# Altium schematic sheet POWER_SUPPLY.SchDoc
size A4; SheetNumber: 1; SheetTotal: 3
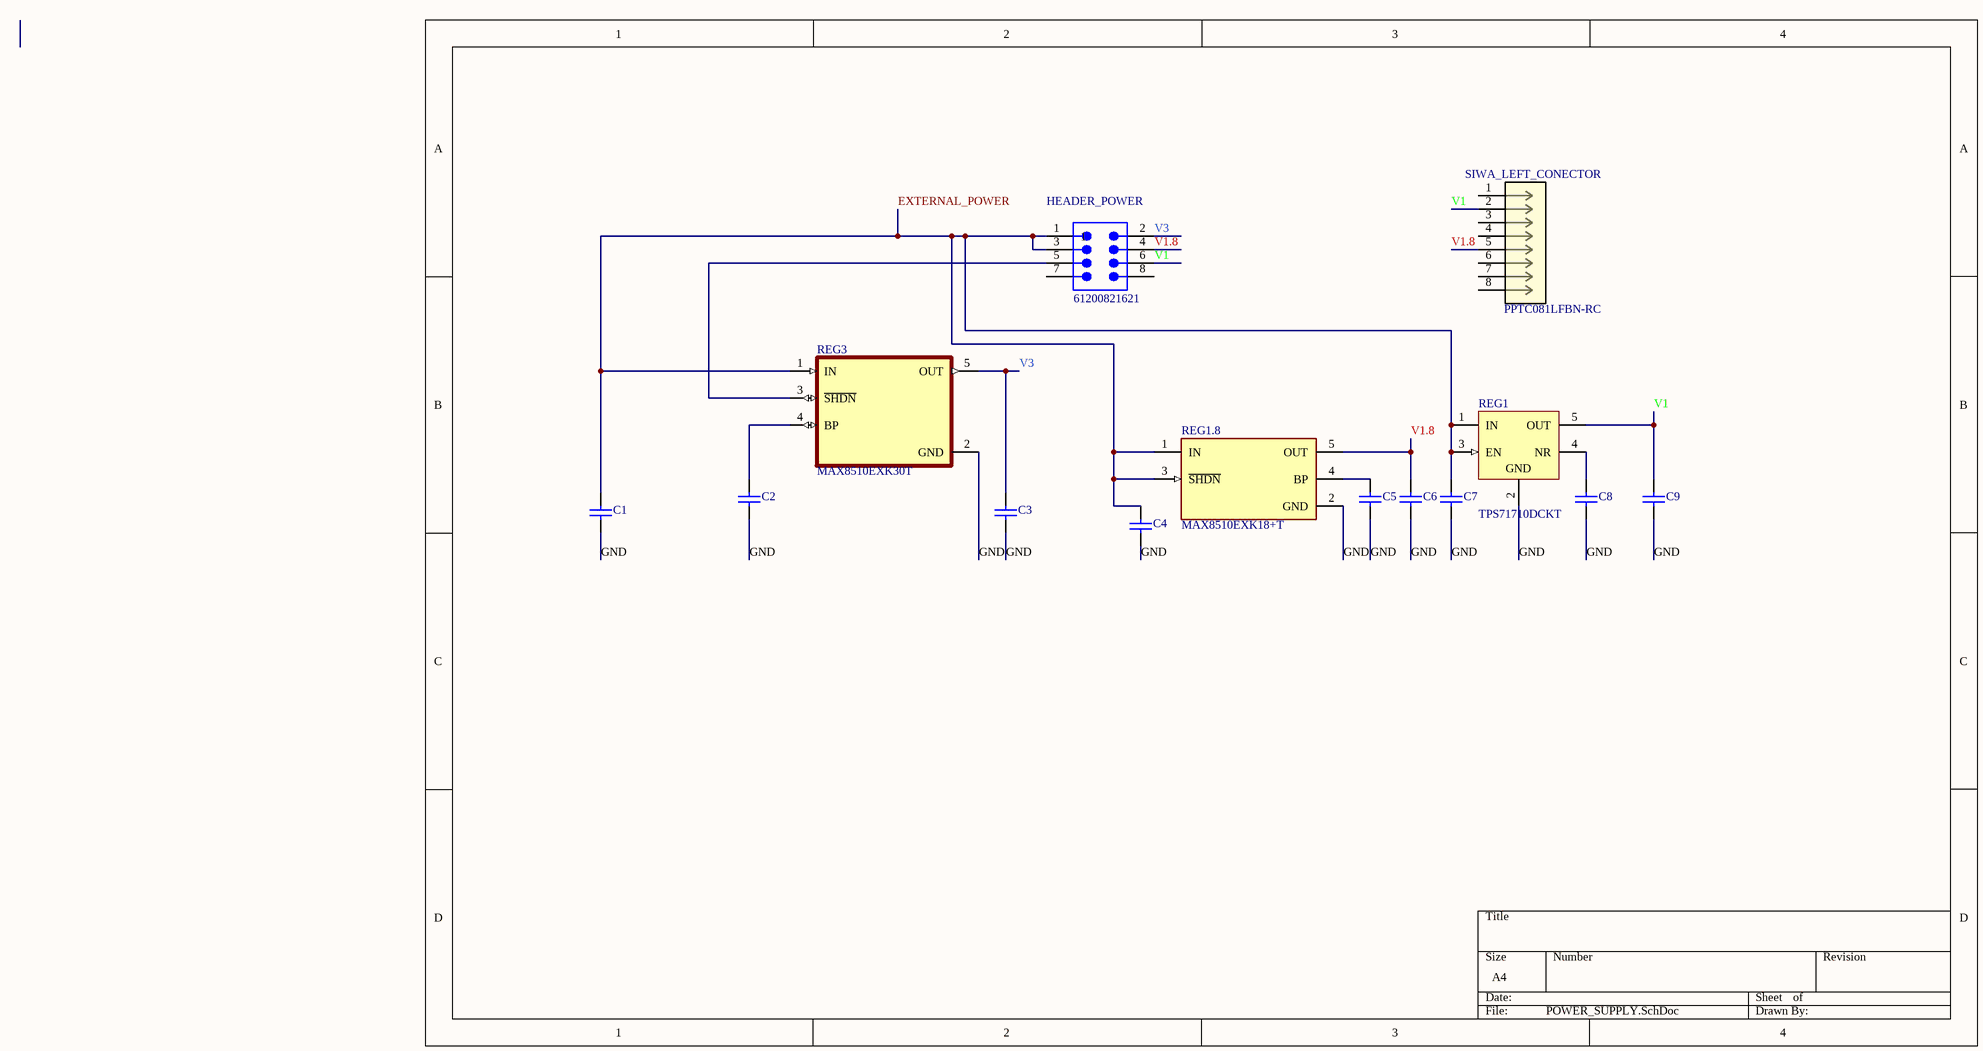
[diagram p0: POWER_SUPPLY.SchDoc]

## Parts
C1  VJ0603Y102KXJAC  [CAPC1608X92X38ML15T08]  (value not drawn)
C2  VJ0603Y102KXJAC  [CAPC1608X92X38ML15T08]  (value not drawn)
C3  VJ0603Y102KXJAC  [CAPC1608X92X38ML15T08]  (value not drawn)
C4  VJ0603Y102KXJAC  [CAPC1608X92X38ML15T08]  (value not drawn)
C5  VJ0603Y102KXJAC  [CAPC1608X92X38ML15T08]  (value not drawn)
C6  VJ0603Y102KXJAC  [CAPC1608X92X38ML15T08]  (value not drawn)
C7  VJ0603Y102KXJAC  [CAPC1608X92X38ML15T08]  (value not drawn)
C8  VJ0603Y102KXJAC  [CAPC1608X92X38ML15T08]  (value not drawn)
C9  VJ0603Y102KXJAC  [CAPC1608X92X38ML15T08]  (value not drawn)
HEADER_POWER  61200821621  [61200821621]
REG1  TPS71710DCKT  [DCK0005A_M]
REG1.8  MAX8510EXK18+T  [FP-X5-1-MFG]
REG3  MAX8510EXK30T  [SOT65P210X110-5N]
SIWA_LEFT_CONECTOR  PPTC081LFBN-RC  [CONN_PPTC081LFBN-RC_SUL]

## Nets
EXTERNAL_POWER: C1.2 C4.2 C7.2 HEADER_POWER.1 HEADER_POWER.3 REG1.1(IN) REG1.3(EN) REG1.8.1(IN) REG1.8.3(~{SHDN}) REG3.1(IN)
GND: C1.1 C2.1 C3.1 C4.1 C5.1 C6.1 C7.1 C8.1 C9.1 REG1.2(GND) REG1.8.2(GND) REG3.2(GND)
V1: C9.2 HEADER_POWER.6 REG1.5(OUT) SIWA_LEFT_CONECTOR.2
V1.8: C6.2 HEADER_POWER.4 REG1.8.5(OUT) SIWA_LEFT_CONECTOR.5
V3: C3.2 HEADER_POWER.2 REG3.5(OUT)
NetC2_2: C2.2 REG3.4(BP)
NetC5_2: C5.2 REG1.8.4(BP)
NetC8_2: C8.2 REG1.4(NR)
NetHEADER_POWER_5: HEADER_POWER.5 REG3.3(~{SHDN})

Not connected (* = marked no-connect by the designer): HEADER_POWER 7 8; SIWA_LEFT_CONECTOR 1 3 4 6 7 8

## Library data of the parts
C1-C9 = CMP-2006-01200-1: Manufacturer: Vitramon; Part Number: VJ0603Y102KXJAC
HEADER_POWER = CMP-1502-00006-3: Wr-bhd; 2.54MM Pitch 8 Way 2 Row Shrouded Straight Pcb Header, Surface Mount; Number of Contacts: 8; Operating Supply Voltage: 250V; Gender: Male; Current Rating: 3A; Contact Resistance: 20mΩ; Connector Type: Male Pin; Insulation Resistance: 1GΩ; Pitch: 2.54mm; RoHS: Compliant; Row Spacing: 2.54mm; Color: Black; Termination: Solder; Min Operating Temperature: -40°C; Number of Rows: 2; Number of Positions: 8; Contact Material: Copper; Orientation: Vertical; Number of Pins: 8; Contact Plating: Gold; Insulation Material: PBT; Lead Pitch: 2.54mm; Length: 17.82mm; Max Operating Temperature: 105°C; Mount: Through Hole
REG1 = CMP-0394-00843-2: Single Output High PSRR LDO, 150 mA, Fixed 1 V Output, 2.5 to 6.5 V Input, with Low IQ, 5-pin SC70 (DCK), -40 to 85 degC, Green (RoHS & no Sb/Br); Manufacturer: Texas Instruments; Fixed Output Options(V): 1; Iq(Typ)(mA): 0.05; Vdo(Typ)(mV): 170; Vin(Min)(V): 2.5; Vin(Max)(V): 6.5; Iout(Max)(A): 0.15; Accuracy(%): 3; SubFamily: Single Channel LDO; PackageReference: DCK0005A; Mounting Technology: Surface Mount; Vout Adj(Max)(V): 1; Eco-Plan: Green (RoHS & no Sb/Br); Vout Adj(Min)(V): 1; ComponentLink1URL: http://www.ti.com/; ComponentLink1Description: Manufacturer URL; ComponentLink2URL: http://www.ti.com/general/docs/lit/getliterature.tsp?genericPartNumber=TPS71710&fileType=pdf; ComponentLink3Description: Package Specification; ComponentLink3URL: http://www.ti.com/litv/pdf/mpds025f; Code_JEDEC: MO-203; DatasheetVersion: SBVS068G; ComponentLink2Description: Datasheet; PackageVersion: 4093553-3/G; PackageDescription: 5-Pin Plastic Small-Outline, Body 2 x 1.25 mm, Pitch 0.65 mm; PartNumber: TPS71710DCKT
REG1.8 = CMP-0246-00401-2: IC REG LINEAR 1.8V 120MA SC70-5; Accuracy: 2%; Number of Outputs: 1; Min Current Limit: 130mA; Max Input Voltage: 6V; Max Power Dissipation: 247mW; Output Configuration: Positive; Output Type: Fixed; Quiescent Current: 90uA; Reference Voltage: 1.225V; Min Input Voltage: 2V; Power Supply Rejection Ratio (PSRR): 54dB; Input Bias Current: 40uA; Output Current: 120mA; Nominal Output Voltage: 1.8V; Output Voltage: 1.8V; Series: -; Number of Regulators: 1; Packaging: Tape and Reel; Mount: Surface Mount; Case/Package: SC; Lead Free: Lead Free; RoHS Compliant: Yes; Number of Pins: 5; Package Quantity: 2500; Max Output Current: 120mA; Polarity: Positive; Min Operating Temperature: -40°C; Max Operating Temperature: 85°C
REG3 = MAX8510EXK30T: DoÄŸrusal Voltaj RegÃ¼latÃ¶rÃ¼ IC Pozitif Sabit 1 Ã‡Ä±kÄ±ÅŸ 120mA SC-70-5; MF: Maxim Integrated Products; MP: MAX8510EXK30+T; SnapEDA_Link: https://www.snapeda.com/parts/MAX8510EXK30+T/Maxim+Integrated/view-part/?ref=snap; Package: SC-70-5 Maxim; Value: *; Check_prices: https://www.snapeda.com/parts/MAX8510EXK30+T/Maxim+Integrated/view-part/?ref=eda
SIWA_LEFT_CONECTOR = PPTC081LFBN-RC: Description; Manufacturer_Name: Sullins; Copyright: Copyright (C) 2026 Ultra Librarian. All rights reserved.; Manufacturer_Part_Number: PPTC081LFBN-RC; RefDes: RefDes; Type: Type